# EAGLE design Jacdaptor_FeatherWing (EAGLE 9.6.2)
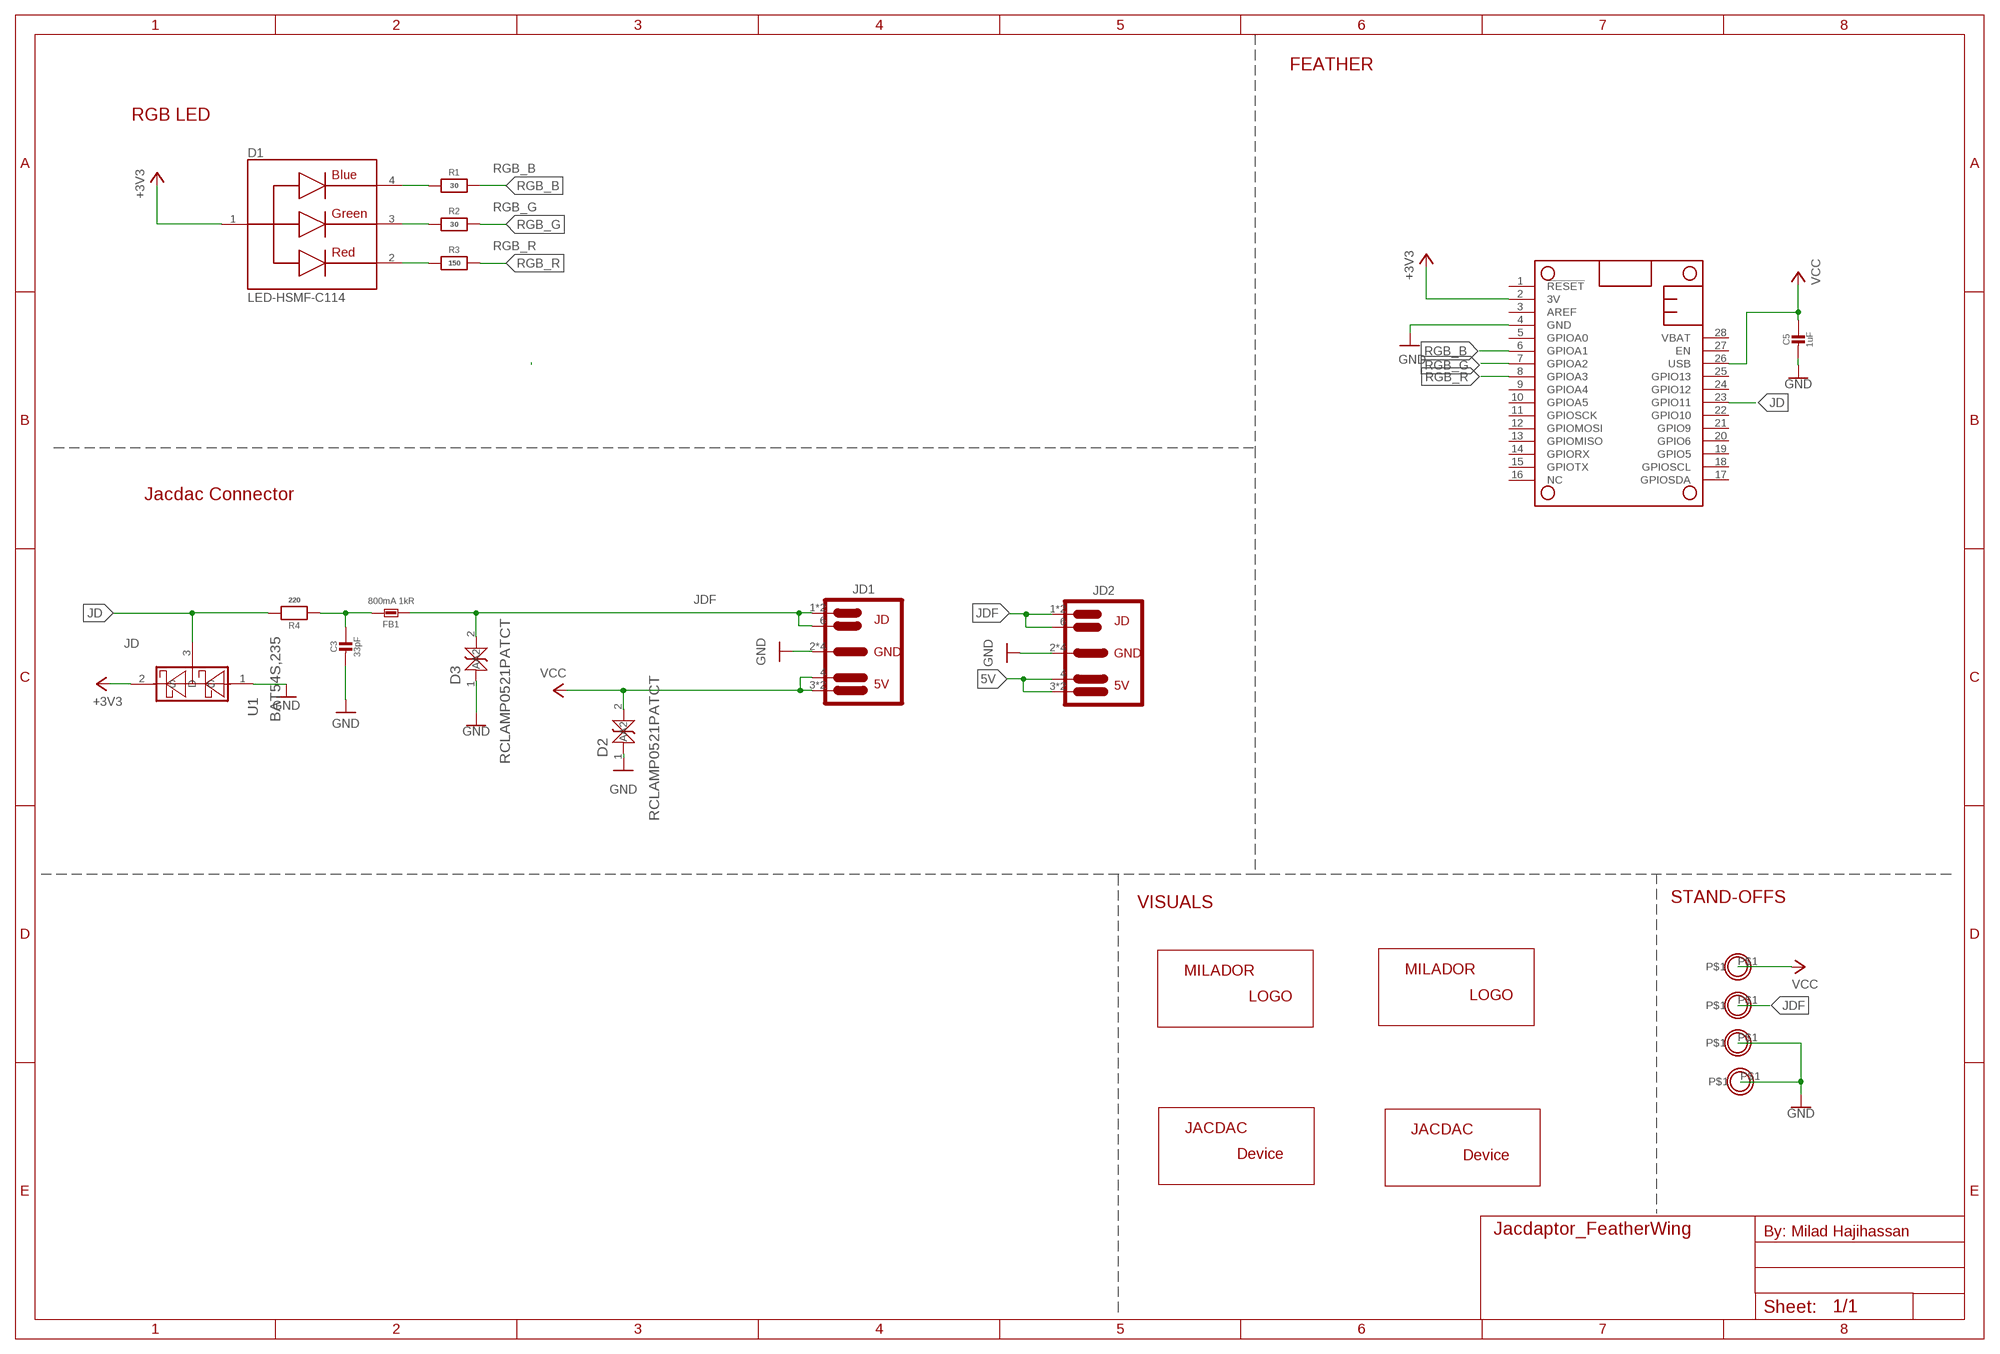
[diagram p0: schematic, sheet 1]

## Parts
C3  33pF  CAP_CERAMIC-0603  [0603]
C5  1uF  CAP_CERAMIC-0603  [0603]
D1  LED-HSMF-C114  [DIOSC160X150X35-4N]
D2  RCLAMP0521PATCT  DIODE-ZENER-RCLAMP0521PATCT  [DIODE-ZENER-0402]
D3  RCLAMP0521PATCT  DIODE-ZENER-RCLAMP0521PATCT  [DIODE-ZENER-0402]
FB1  800mA 1kR  FERRITE-BEAD-0603-NO  [0603-NO]
H1  MOUNTINGHOLE2.5  [MOUNTINGHOLE_2.5_PLATED]
H2  MOUNTINGHOLE2.5  [MOUNTINGHOLE_2.5_PLATED]
H3  MOUNTINGHOLE2.5  [MOUNTINGHOLE_2.5_PLATED]
H4  MOUNTINGHOLE2.5  [MOUNTINGHOLE_2.5_PLATED]
JD1  JACDAC-EDGE-INNIE  [JD-EDGE-INNIE]
JD2  JACDAC-EDGE-INNIE  [JD-EDGE-INNIE]
LABEL_DEVICE_BOTTOM  MILADOR-JACDAC-DEVICE-JACDAPTOR-WING  [JACDAPTOR-FEATHERWING]
LABEL_DEVICE_TOP  MILADOR-JACDAC-DEVICE-JACDAPTOR-WING-SM  [JACDAPTOR-FEATHERWING-SM]
LABEL_LOGO_BOTTOM  MILADOR-LOGO-SM  [MILADOR_LOGO2]
LABEL_LOGO_TOP  MILADOR-LOGO-SM  [MILADOR_LOGO2]
MS1  ADAFRUIT_FEATHERWING_NODIM  [ADAFRUIT_FEATHERWING_DIM]
R1  30  RESISTOR-0603  [0603]
R2  30  RESISTOR-0603  [0603]
R3  150  RESISTOR-0603  [0603]
R4  220  RESISTOR-0603  [0603]
U1  BAT54S,235  [SOT23-3]

## Nets
5V: C5.1 D2.2(A2) H1.P$1 JD1.3 JD1.4 JD1.P$1 JD2.3 JD2.4 JD2.P$1 MS1.26(USB) ; supply symbol labelled VCC
+3V3: D1.1 MS1.2(3V) U1.2(S)
GND: C3.2 C5.2 D2.1(A) D3.1(A) H3.P$1 H4.P$1 JD1.2 JD1.5 JD1.P$2 JD1.P$4 JD2.2 JD2.5 JD2.P$2 JD2.P$4 MS1.4(GND) U1.1(G)
JD: MS1.23(GPIO11) R4.2 U1.3(D)
JDF: D3.2(A2) FB1.2 H2.P$1 JD1.1 JD1.6 JD1.P$3 JD2.1 JD2.6 JD2.P$3
N$1: D1.4 R1.1
N$2: D1.3 R2.1
N$3: D1.2 R3.1
N$4: C3.1 FB1.1 R4.1
RGB_B: MS1.6(GPIOA1) R1.2
RGB_G: MS1.7(GPIOA2) R2.2
RGB_R: MS1.8(GPIOA3) R3.2
Unconnected: MS1.1(!RESET) MS1.3(AREF) MS1.5(GPIOA0) MS1.9(GPIOA4) MS1.10(GPIOA5) MS1.11(GPIOSCK) MS1.12(GPIOMOSI) MS1.13(GPIOMISO) MS1.14(GPIORX) MS1.15(GPIOTX) MS1.16(NC) MS1.17(GPIOSDA) MS1.18(GPIOSCL) MS1.19(GPIO5) MS1.20(GPIO6) MS1.21(GPIO9) MS1.22(GPIO10) MS1.24(GPIO12) MS1.25(GPIO13) MS1.27(EN) MS1.28(VBAT)

## Notes on the sheet
- FEATHER
- RGB LED
- Jacdac Connector
- STAND-OFFS
- VISUALS
- By: Milad Hajihassan

## Library data of the parts
C3 C5 = milador_SMD:CAP_CERAMIC-: Ceramic Capacitors For new designs, use the packages preceded by an '_' character since they are more reliable: The following footprints should be used on most boards: _0402 - Standard footprint for regular board layouts _0603 - Standard footprint for regular board layouts _0805 - Standard footprint for regular board layouts _1206 - Standard footprint for regular board layouts For extremely tight-pitch boards where space is at a premium, the following 'micro-pitch' footprints can be used (smaller pads, no silkscreen outline, etc.): _0402MP - Micro-pitch footprint for very dense/compact boards _0603MP - Micro-pitch footprint for very dense/compact boards _0805MP - Micro-pitch footprint for very dense/compact boards _1206MP - Micro-pitch footprint for very dense/compact boards
D1 = milador_SMD:LED-HSMF-C114: LED Tri-Color Blue/Green/Red 468nm/523nm/637nm 4-Pin Chip LED T/R Check prices <https://pricing.snapeda.com/parts/HSMF-C114/Broadcom%20Limited/view-part?ref=eda>; DESCRIPTION: Red, Green, Blue (RGB) 626nm Red, 525nm Green, 470nm Blue LED Indication - Discrete 1.9V Red, 3.4V Green, 3.4V Blue 0606 (1616 Metric); MF: Broadcom Limited; MP: HSMF-C114; PACKAGE: 0606 Avago; PRICE: None; PURCHASE-URL: https://pricing.snapeda.com/search/part/HSMF-C114/?ref=eda
D2 D3 = milador_SMD:DIODE-ZENER-; COPYRIGHT: Copyright (C) 2021 Ultra Librarian. All rights reserved.; DIGI-KEY_PART_NUMBER_1: RCLAMP0521PACT-ND; DIGI-KEY_PART_NUMBER_2: RCLAMP0521PADKR-ND; DIGI-KEY_PART_NUMBER_3: RCLAMP0521PATR-ND; MANUFACTURER_PART_NUMBER: RCLAMP0521PATCT; MFR_NAME: Semtech
FB1 = milador_SMD:FERRITE-BEAD-: Ferrite Beads
H1-H4 = milador:MOUNTINGHOLE: Mounting Hole For #2 screws (0.086"/2.18mm width, 0.094"/2.4mm hole) use 2.5mm; BOM: EXCLUDE
JD1 JD2 = milador:JACDAC-EDGE
LABEL_DEVICE_BOTTOM LABEL_DEVICE_TOP = milador:MILADOR-JACDAC-DEVICE-
LABEL_LOGO_BOTTOM LABEL_LOGO_TOP = milador:MILADOR-LOGO-
MS1 = milador:ADAFRUIT_FEATHERWING
R1-R4 = milador_SMD:RESISTOR-: Resistors For new designs, use the packages preceded by an '_' character since they are more reliable: The following footprints should be used on most boards: _0402 - Standard footprint for regular board layouts _0603 - Standard footprint for regular board layouts _0805 - Standard footprint for regular board layouts _1206 - Standard footprint for regular board layouts For extremely tight-pitch boards where space is at a premium, the following 'micro-pitch' footprints can be used (smaller pads, no silkscreen outline, etc.): _0402MP - Micro-pitch footprint for very dense/compact boards _0603MP - Micro-pitch footprint for very dense/compact boards _0805MP - Micro-pitch footprint for very dense/compact boards _1206MP - Micro-pitch footprint for very dense/compact boards
U1 = milador_SMD:BAT54S,235: BAT54S,235 Schottky Diode; DESCRIPTION: N-Channel 50V 200mA (Ta) 300mW (Ta) Surface Mount SOT-23-3; MF: Diodes; MP: BSS138-7-F; PACKAGE: SOT-23-3 Fairchild Semiconductor; PRICE: None; PURCHASE-URL: https://pricing.snapeda.com/search/part/BSS138-7-F/?ref=eda

## Board
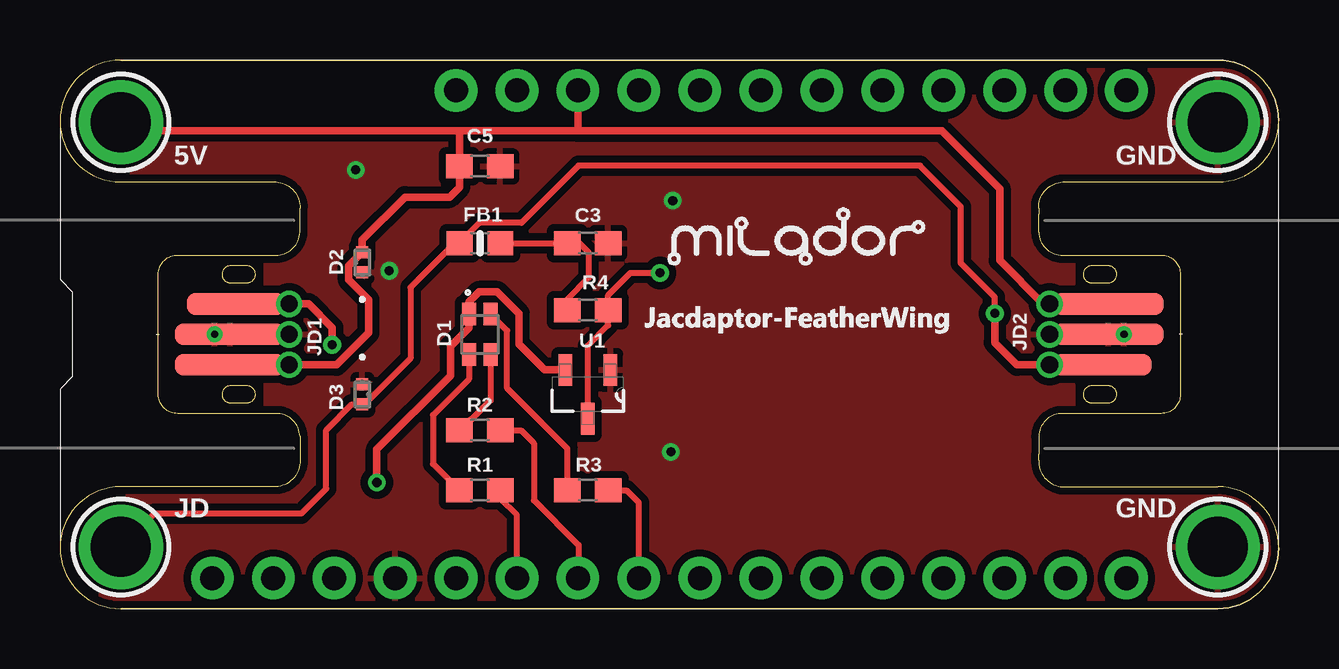
[diagram p1: board, top side]
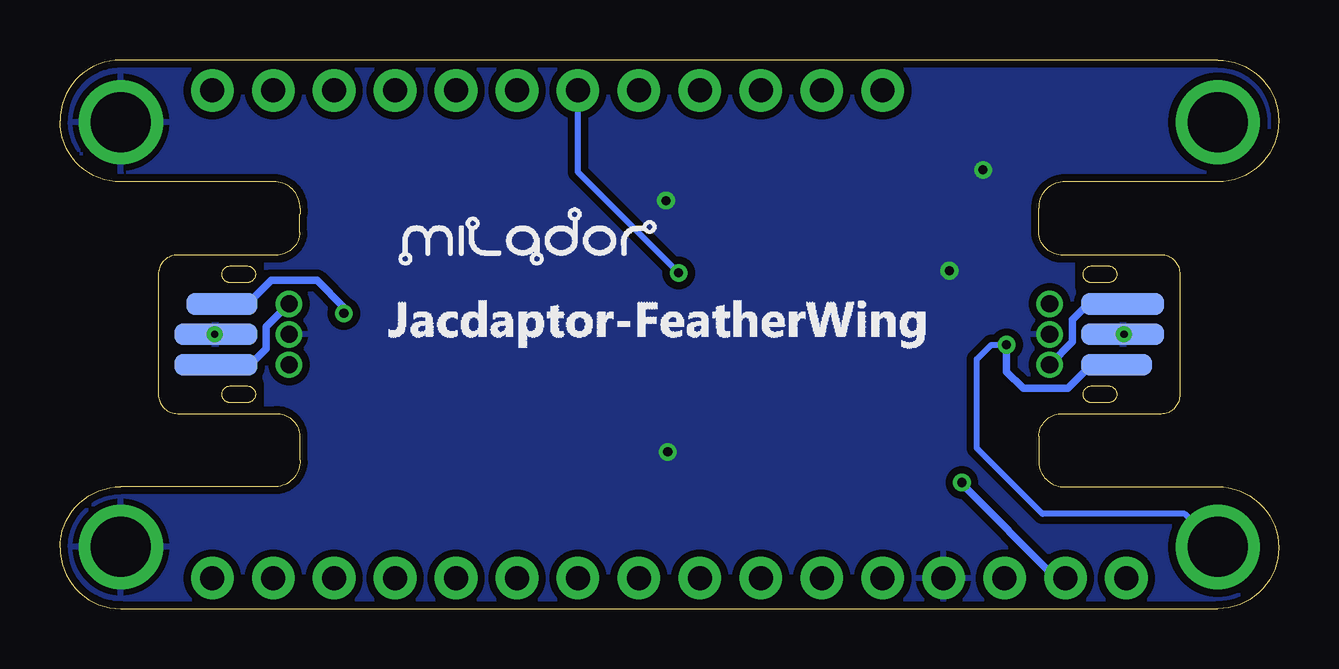
[diagram p2: board, bottom side, seen from below]

Size 50.8 x 22.86 mm. Coordinates in mm from the lower left corner, seen from the top.
Outline: 10,16.43 10,16.68 arc90 9,17.78 2.54,17.78 arc-90 0,20.32 arc-90 2.54,22.86 48.26,22.86 arc-90 50.8,20.32 arc-90 48.26,17.78 41.8,17.78 arc90 40.8,16.68 40.8,16.43
Outline: 10,6.43 10,6.18 arc-90 9,5.08 2.54,5.08 arc90 0,2.54 arc90 2.54,0 48.26,0 arc90 50.8,2.54 arc90 48.26,5.08 41.8,5.08 arc-90 40.8,6.18 40.8,6.43
Copper layers (1*16): Top 0.035mm / dielectric 1.5mm / Bottom 0.035mm
Design rules "SparkFun-2-layer-TIGHT *": minimum track width 7mil, minimum drill 15mil, track to track 1mil, track to pad 1mil, pad to pad 1mil, via to via 1mil, smd to smd 1mil, copper to edge 1mil, drill to drill 1mil, minimum pad ring 7mil, minimum via ring 7mil, stop-mask expansion 4mil, vias tented up to drill 25mil, thermal gap 10mil

### Footprints (pad centres in the part's own frame; a part is rotated, then mirrored left to right if it is on the bottom)
0603 = smd 1.1 x 1: 1 -0.85,0; 2 0.85,0
DIOSC160X150X35-4N = smd 0.94 x 0.57: 1 -0.845,-0.45; 2 -0.845,0.45; 3 0.845,0.45; 4 0.845,-0.45
DIODE-ZENER-0402 = smd 0.508 x 0.508: 1 -0.419,0; 2 0.419,0
0603-NO = smd 1.075 x 1: 1 -0.85,0; 2 0.85,0
MOUNTINGHOLE_2.5_PLATED = drill 2.5 pad 3.2: P$1 0,0
JD-EDGE-INNIE = smd 0.9 x 4.1: 1 1.27,-3.25 | smd 0.9 x 4.6: 2 0,-3; 3 -1.27,-3 | smd 0.9 x 3.45 bottom: 4 1.27,-2.4; 5 0,-2.4 | smd 0.9 x 2.95 bottom: 6 -1.27,-2.65 | drill 0.71 pad 1.1: P$1 -1.27,-5.45; P$2 0,-5.45; P$3 1.27,-5.45 | drill 0.305 pad 0.559: P$4 0,-2.35
ADAFRUIT_FEATHERWING_DIM = drill 1 pad 1.778: 1 6.35,1.27; 2 8.89,1.27; 3 11.43,1.27; 4 13.97,1.27; 5 16.51,1.27; 6 19.05,1.27; 7 21.59,1.27; 8 24.13,1.27; 9 26.67,1.27; 10 29.21,1.27; 11 31.75,1.27; 12 34.29,1.27; 13 36.83,1.27; 14 39.37,1.27; 15 41.91,1.27; 16 44.45,1.27; 17 44.45,21.59; 18 41.91,21.59; 19 39.37,21.59; 20 36.83,21.59; 21 34.29,21.59; 22 31.75,21.59; 23 29.21,21.59; 24 26.67,21.59; 25 24.13,21.59; 26 21.59,21.59; 27 19.05,21.59; 28 16.51,21.59
SOT23-3 = smd 1.321 x 0.559: 1 -1.016,0.94; 2 -1.016,-0.94; 3 1.016,0

### Placement (x,y rotation side)
C3  22,15.23 0 top
C5  17.5,18.43 0 top
D1  17.5,11.43 270 top
D2  12.6,14.43 90 top
D3  12.6,8.93 270 top
FB1  17.5,15.23 180 top
H1  2.54,20.27 0 top
H2  2.54,2.57 0 top
H3  48.26,20.27 0 top
H4  48.26,2.57 0 top
JD1  4.1,11.43 90 top
JD2  46.7,11.43 270 top
LABEL_DEVICE_BOTTOM  26,12 0 bottom
LABEL_DEVICE_TOP  30,12 0 top
LABEL_LOGO_BOTTOM  32,15 0 bottom
LABEL_LOGO_TOP  30,15 0 top
MS1  0,0 0 top
R1  17.5,4.93 0 top
R2  17.5,7.43 0 top
R3  22,4.93 0 top
R4  22,12.43 0 top
U1  22,8.93 270 top

### Tracks (layer width: path | path; a pad name or v marks a point on that pad's centre or on a via)
5V
  Top 0.178: JD2.3 JD2.P$1 | JD1.3 JD1.P$1 | JD1.3 6.77,10.16 6.52,10.41 6.85,10.41 JD1.3
  Top 0.305: 21.59,19.9 36.76,19.9 39.17,17.5 39.17,14.51 40.98,12.7 JD2.P$1 | MS1.26 21.59,19.9 | H1.P$1 2.54,20.24 2.87,19.9 16.65,19.9 | 21.59,19.9 16.65,19.9 | JD1.P$1 11.53,10.16 12.86,11.49 12.86,12.88 12.03,13.7 12.03,14.28 D2.2 12.6,15.37 14.38,17.14 16.23,17.14 16.65,17.56 C5.1 16.65,19.9
  Bottom 0.178: JD2.4 42.87,10.16 | JD1.4 7.93,12.7
  Bottom 0.29: JD2.P$1 | JD1.P$1
  Bottom 0.305: 42.87,10.16 42.2,10.83 42.2,11.75 JD2.P$1 | JD1.P$1 8.6,11.11 8.6,12.03 7.93,12.7
+3V3  (via drill 0.38)
  Top 0.305: v13.21,5.26 13.21,6.63 16.28,9.71 16.28,10.93 17.05,11.7 D1.1 17.05,12.79 17.46,13.2 18.22,13.2 19.13,12.29 19.13,11.01 20.19,9.95 U1.2
  Bottom 0.305: v13.21,5.26 13.21,5.2 9.28,1.27 MS1.2
GND  (via drill 0.38)
  Top 0.178: JD2.P$2 JD2.2 JD2.P$4 | JD1.P$4 JD1.2 JD1.P$2
  other vias: 25.54,17 25.46,6.53 13.73,14.08 12.33,18.28
  pour Bottom (isolate 0.305): 50.8,22.86 50.8,0 0,0 0,22.86
  pour Top (isolate 0.305): 50.8,22.86 50.8,0 0,0 0,22.86
JD  (via drill 0.38)
  Top 0.254: v25.01,13.99 23.78,13.99 22.85,13.06 R4.2 22.85,11.8 22,10.96 U1.3
  Bottom 0.254: v25.01,13.99 29.21,18.19 MS1.23
JDF  (via drill 0.38)
  Top 0.178: JD2.1 JD2.P$3 | JD1.1 JD1.P$3
  Top 0.254: H2.P$1 3.93,3.96 10.06,3.96 11.1,5 11.1,7.44 12.16,8.51 D3.2 12.7,8.51 14.61,10.42 14.61,13.39 16.45,15.23 FB1.2 17.5,16.08 19.24,16.08 21.61,18.46 35.84,18.46 37.55,16.75 37.55,14.39 38.97,12.98 v38.97,12.3
  Top 0.305: JD2.P$3 39.89,10.16 38.97,11.09 v38.97,12.3 | JD1.P$3 10.36,12.7 11.35,11.71 v11.35,10.99
  Bottom 0.178: JD2.6 42.98,12.7 | JD1.6 7.82,10.16
  Bottom 0.2: v11.35,10.99
  Bottom 0.254: H2.P$1 3.92,3.95 9.85,3.95 12.58,6.68 12.58,10.39 11.99,10.99 v11.35,10.99
  Bottom 0.305: 7.82,10.16 8.8,9.18 10.65,9.18 11.35,9.88 v11.35,10.99 | 42.98,12.7 42,13.68 40.09,13.68 38.97,12.56 v38.97,12.3
N$1
  Top 0.254: D1.4 17.05,9.56 15.55,8.06 15.55,6.03 R1.1
N$2
  Top 0.254: R2.1 17.11,7.89 17.17,7.89 17.95,8.68 D1.3
N$3
  Top 0.254: R3.1 21.15,6.67 18.64,9.17 18.64,11.58 D1.2
N$4
  Top 0.254: FB1.1 C3.1 21.65,15.23 22.04,14.84 22.04,13.78 21.15,12.89 R4.1
RGB_B
  Top 0.254: R1.2 18.35,4.61 19.05,3.91 MS1.6
RGB_G
  Top 0.254: MS1.7 21.61,1.29 21.61,2.65 19.75,4.51 19.75,6.89 19.21,7.43 R2.2
RGB_R
  Top 0.254: MS1.8 24.13,4.41 23.61,4.93 R3.2

### Text on the board
tPlace: 5V | GND | JD | GND